# Altium project PCB_Project.PrjPcb
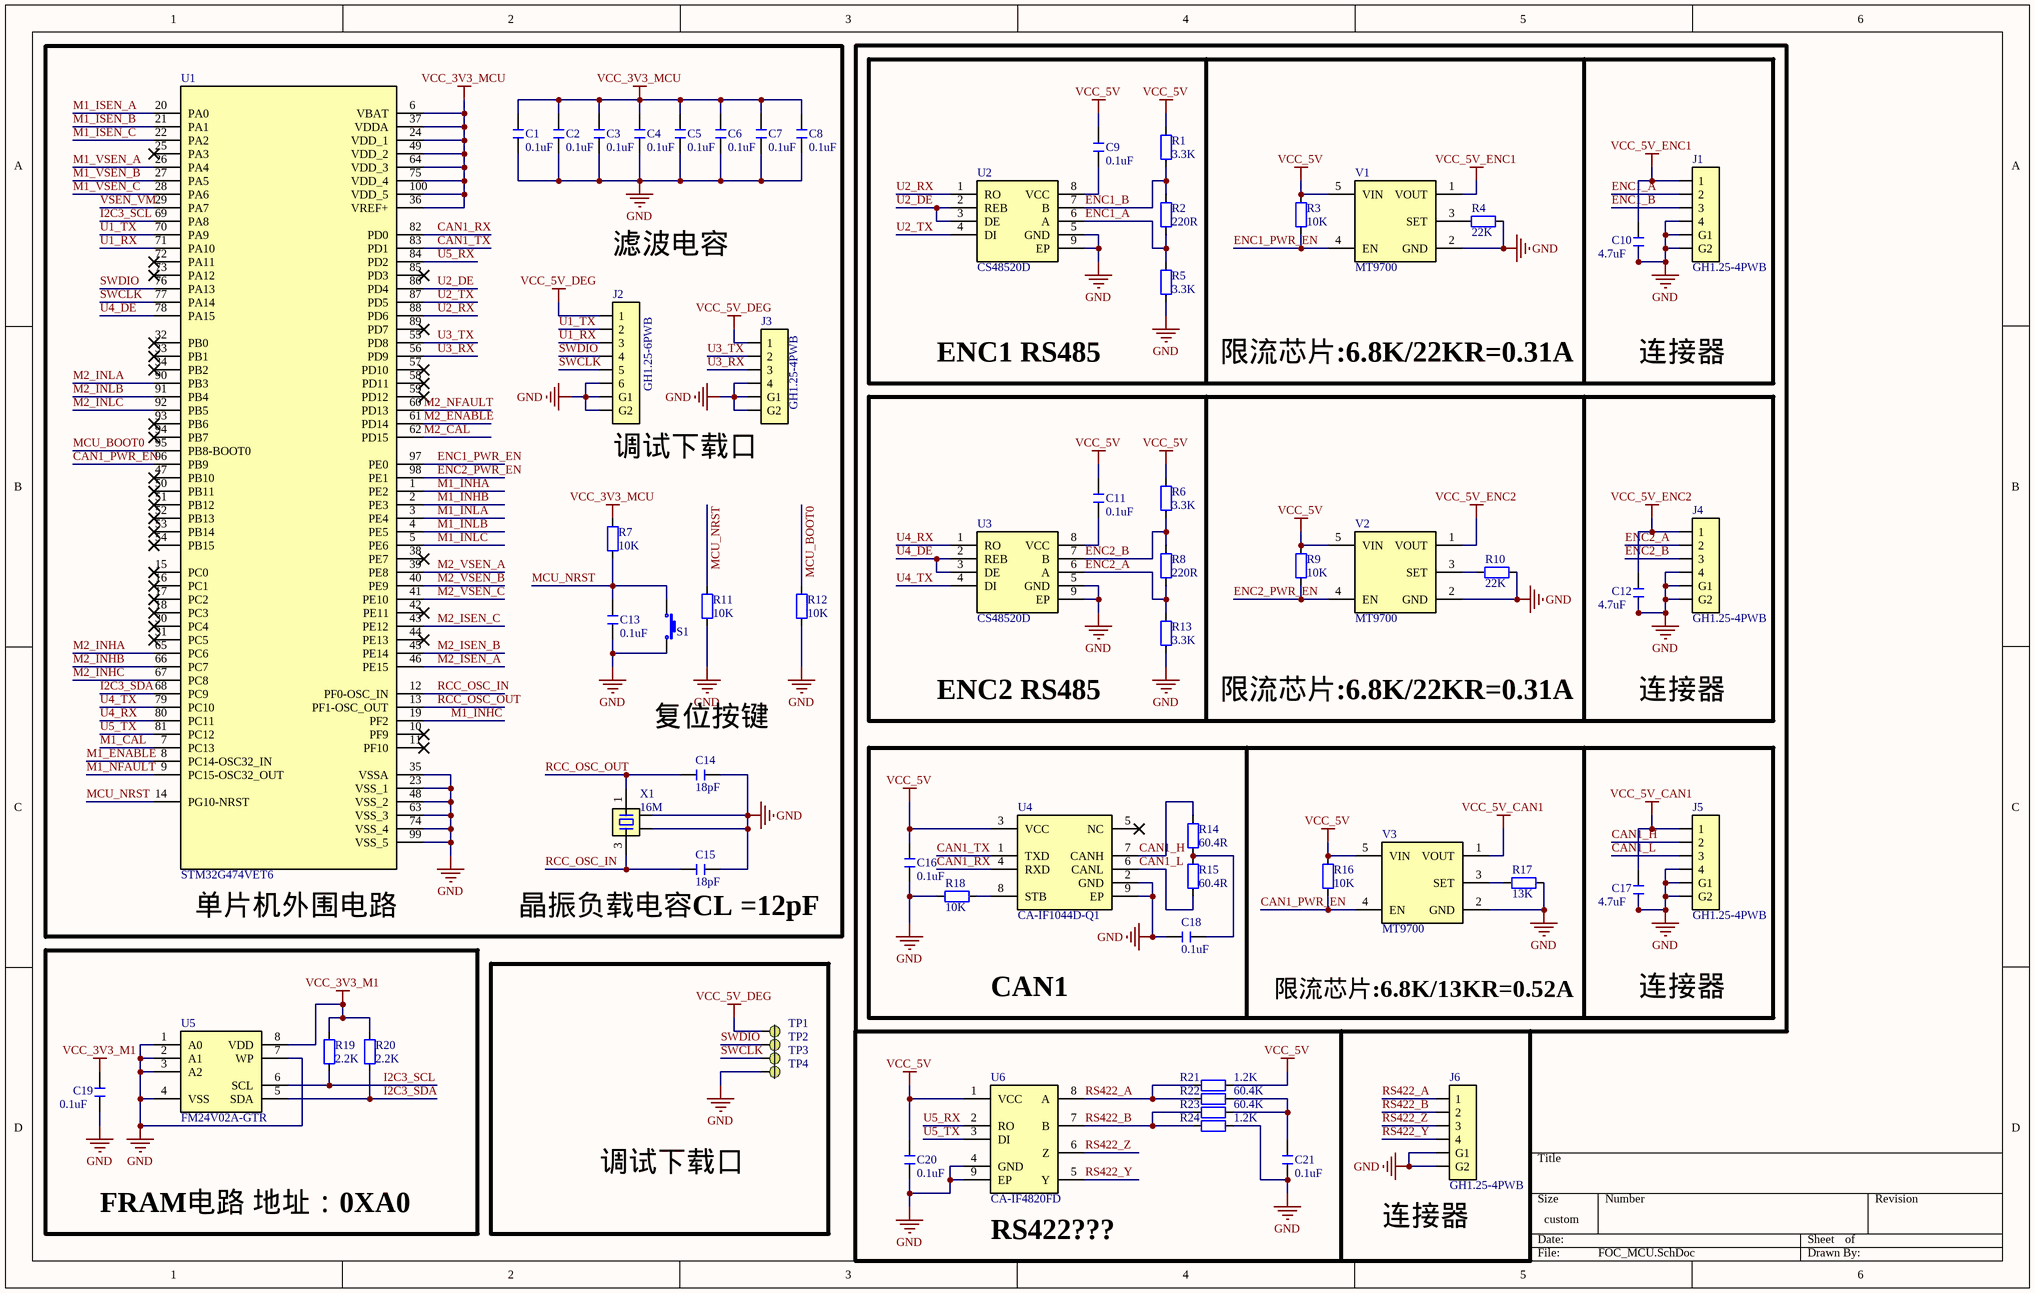
[diagram p0: FOC_MCU.SchDoc]
3 sheets, 186 parts. Net scope: global (net labels, ports and power ports of the same name join across sheets).
Board file: Tow_FOC.PcbDoc
Sheets:
  FOC_MCU.SchDoc
  FOC_Power.SchDoc
  FOC_Drive.SchDoc

## Sheet FOC_MCU.SchDoc
size 381 x 241 mm; SheetNumber: 1; SheetTotal: 3

### Parts
C1  0.1uF  [C 0603_L]
C2  0.1uF  [C 0603_L]
C3  0.1uF  [C 0603_L]
C4  0.1uF  [C 0603_L]
C5  0.1uF  [C 0603_L]
C6  0.1uF  [C 0603_L]
C7  0.1uF  [C 0603_L]
C8  0.1uF  [C 0603_L]
C9  0.1uF  [C 0603_L]
C10  4.7uF  [C 0603_L]
C11  0.1uF  [C 0603_L]
C12  4.7uF  [C 0603_L]
C13  0.1uF  [C 0603_L]
C14  18pF  [C 0603_L]
C15  18pF  [C 0603_L]
C16  0.1uF  [C 0603_L]
C17  4.7uF  [C 0603_L]
C18  0.1uF  [C 0603_L]
C19  0.1uF  [C 0603_L]
C20  0.1uF  [C 0603_L]
C21  0.1uF  [C 0603_L]
J1  GH1.25-4PWB  [GH1.25-4PWB]
J2  GH1.25-6PWB  [GH1.25-6PWB]
J3  GH1.25-4PWB  [GH1.25-4PWB]
J4  GH1.25-4PWB  [GH1.25-4PWB]
J5  GH1.25-4PWB  [GH1.25-4PWB]
J6  GH1.25-4PWB  [GH1.25-4PWB]
R1  3.3K  [R 0603_L]
R2  220R  [R 0603_L]
R3  10K  [R 0603_L]
R4  22K  [R 0603_L]
R5  3.3K  [R 0603_L]
R6  3.3K  [R 0603_L]
R7  10K  [R 0603_L]
R8  220R  [R 0603_L]
R9  10K  [R 0603_L]
R10  22K  [R 0603_L]
R11  10K  [R 0603_L]
R12  10K  [R 0603_L]
R13  3.3K  [R 0603_L]
R14  60.4R  [R 0603_L]
R15  60.4R  [R 0603_L]
R16  10K  [R 0603_L]
R17  13K  [R 0603_L]
R18  10K  [R 0603_L]
R19  2.2K  [R 0603_L]
R20  2.2K  [R 0603_L]
R21  1.2K  [R 0603_L]
R22  60.4K  [R 0603_L]
R23  60.4K  [R 0603_L]
R24  1.2K  [R 0603_L]
S1  TS-1089S-02526  [SMD_TS-1089S]  (value not drawn)
TP1  (no value)  [TP_RECT_2x2]
TP2  (no value)  [TP_RECT_2x2]
TP3  (no value)  [TP_RECT_2x2]
TP4  (no value)  [TP_RECT_2x2]
U1  STM32G474VET6  [LQFP100_L]
U2  CS48520D  [DFN65P300X75-9N]
U3  CS48520D  [DFN65P300X75-9N]
U4  CA-IF1044D-Q1  [DFN65P300X75-9N]
U5  FM24V02A-GTR  [SOIC-8N]
U6  CA-IF4820FD  [DFN65P300X75-9N]
V1  MT9700  [SOT-23-5]
V2  MT9700  [SOT-23-5]
V3  MT9700  [SOT-23-5]
X1  16M  [OSC 2016-4P]

### Blocks framed on the sheet
FRAM电路 地址：0XA0: C19 R19 R20 U5
调试下载口: TP1-TP4

### Nets
GND: C1.2 C2.2 C3.2 C4.2 C5.2 C6.2 C7.2 C8.2 C10.1 C12.1 C13.2 C14.1 C15.1 C16.1 C17.1 C18.1 C19.1 C20.1 C21.1 J1.4 J1.G1 J1.G2 J2.6 J2.G1 J2.G2 J3.4 J3.G1 J3.G2 J4.4 J4.G1 J4.G2 J5.4 J5.G1 J5.G2 J6.G1 J6.G2 R4.1 R5.1 R10.1 R11.2 R12.2 R13.1 R17.1 R18.2 R24.1 S1.1 TP4.1 U1.23(VSS_1) U1.35(VSSA) U1.48(VSS_2) U1.63(VSS_3) U1.74(VSS_4) U1.99(VSS_5) U2.5(GND) U2.9(EP) U3.5(GND) U3.9(EP) U4.2(GND) U4.9(EP) U5.1(A0) U5.2(A1) U5.3(A2) U5.4(VSS) U5.7(WP) U6.4(GND) U6.9(EP) V1.2(GND) V2.2(GND) V3.2(GND) X1.2 X1.4
VCC_3V3_M1: C19.2 R19.2 R20.2 U5.8(VDD)
VCC_3V3_MCU: C1.1 C2.1 C3.1 C4.1 C5.1 C6.1 C7.1 C8.1 R7.1 U1.6(VBAT) U1.24(VDD_1) U1.36(VREF+) U1.37(VDDA) U1.49(VDD_2) U1.64(VDD_3) U1.75(VDD_4) U1.100(VDD_5)
VCC_5V: C9.2 C11.2 C16.2 C20.2 R1.2 R3.2 R6.2 R9.2 R16.2 R21.1 U4.3(VCC) U6.1(VCC) V1.5(VIN) V2.5(VIN) V3.5(VIN)
VCC_5V_CAN1: C17.2 J5.1 V3.1(VOUT)
VCC_5V_DEG: J2.1 J3.1 TP1.1
VCC_5V_ENC1: C10.2 J1.1 V1.1(VOUT)
VCC_5V_ENC2: C12.2 J4.1 V2.1(VOUT)
CAN1_H: J5.2 R14.1 U4.7(CANH)
CAN1_L: J5.3 R15.2 U4.6(CANL)
CAN1_PWR_EN: R16.1 U1.96(PB9) V3.4(EN)
CAN1_RX: U1.82(PD0) U4.4(RXD)
CAN1_TX: U1.83(PD1) U4.1(TXD)
ENC1_A: J1.2 R2.1 R5.2 U2.6(A)
ENC1_B: J1.3 R1.1 R2.2 U2.7(B)
ENC1_PWR_EN: R3.1 U1.97(PE0) V1.4(EN)
ENC2_A: J4.2 R8.1 R13.2 U3.6(A)
ENC2_B: J4.3 R6.1 R8.2 U3.7(B)
ENC2_PWR_EN: R9.1 U1.98(PE1) V2.4(EN)
I2C3_SCL: R19.1 U1.69(PA8) U5.6(SCL)
I2C3_SDA: R20.1 U1.68(PC9) U5.5(SDA)
M1_CAL: U1.7(PC13)
M1_ENABLE: U1.8(PC14-OSC32_IN)
M1_INHA: U1.1(PE2)
M1_INHB: U1.2(PE3)
M1_INHC: U1.19(PF2)
M1_INLA: U1.3(PE4)
M1_INLB: U1.4(PE5)
M1_INLC: U1.5(PE6)
M1_ISEN_A: U1.20(PA0)
M1_ISEN_B: U1.21(PA1)
M1_ISEN_C: U1.22(PA2)
M1_NFAULT: U1.9(PC15-OSC32_OUT)
M1_VSEN_A: U1.26(PA4)
M1_VSEN_B: U1.27(PA5)
M1_VSEN_C: U1.28(PA6)
M2_CAL: U1.62(PD15)
M2_ENABLE: U1.61(PD14)
M2_INHA: U1.65(PC6)
M2_INHB: U1.66(PC7)
M2_INHC: U1.67(PC8)
M2_INLA: U1.90(PB3)
M2_INLB: U1.91(PB4)
M2_INLC: U1.92(PB5)
M2_ISEN_A: U1.46(PE15)
M2_ISEN_B: U1.45(PE14)
M2_ISEN_C: U1.43(PE12)
M2_NFAULT: U1.60(PD13)
M2_VSEN_A: U1.39(PE8)
M2_VSEN_B: U1.40(PE9)
M2_VSEN_C: U1.41(PE10)
MCU_BOOT0: R12.1 U1.95(PB8-BOOT0)
MCU_NRST: C13.1 R7.2 R11.1 S1.2 U1.14(PG10-NRST)
RCC_OSC_IN: C15.2 U1.12(PF0-OSC_IN) X1.3
RCC_OSC_OUT: C14.2 U1.13(PF1-OSC_OUT) X1.1
RS422_A: J6.1 R21.2 R22.2 U6.8(A)
RS422_B: J6.2 R23.2 R24.2 U6.7(B)
RS422_Y: J6.4 U6.5(Y)
RS422_Z: J6.3 U6.6(Z)
SWCLK: J2.5 TP3.1 U1.77(PA14)
SWDIO: J2.4 TP2.1 U1.76(PA13)
U1_RX: J2.3 U1.71(PA10)
U1_TX: J2.2 U1.70(PA9)
U2_DE: U1.86(PD4) U2.2(REB) U2.3(DE)
U2_RX: U1.88(PD6) U2.1(RO)
U2_TX: U1.87(PD5) U2.4(DI)
U3_RX: J3.3 U1.56(PD9)
U3_TX: J3.2 U1.55(PD8)
U4_DE: U1.78(PA15) U3.2(REB) U3.3(DE)
U4_RX: U1.80(PC11) U3.1(RO)
U4_TX: U1.79(PC10) U3.4(DI)
U5_RX: U1.84(PD2) U6.2(RO)
U5_TX: U1.81(PC12) U6.3(DI)
VSEN_VM: U1.29(PA7)
NetC9_1: C9.1 U2.8(VCC)
NetC11_1: C11.1 U3.8(VCC)
NetC18_2: C18.2 R14.2 R15.1
NetC21_2: C21.2 R22.1 R23.1
NetR4_2: R4.2 V1.3(SET)
NetR10_2: R10.2 V2.3(SET)
NetR17_2: R17.2 V3.3(SET)
NetR18_1: R18.1 U4.8(STB)

Not connected (* = marked no-connect by the designer): U1 10(PF9)* 11(PF10)* 15(PC0)* 16(PC1)* 17(PC2)* 18(PC3)* 25(PA3)* 30(PC4)* 31(PC5)* 32(PB0)* 33(PB1)* 34(PB2)* 38(PE7)* 42(PE11)* 44(PE13)* 47(PB10)* 50(PB11)* 51(PB12)* 52(PB13)* 53(PB14)* 54(PB15)* 57(PD10)* 58(PD11)* 59(PD12)* 72(PA11)* 73(PA12)* 85(PD3)* 89(PD7)* 93(PB6)* 94(PB7)*; U4 5(NC)*

### Notes on the sheet
- 滤波电容
- ENC1 RS485
- 限流芯片:6.8K/22KR=0.31A
- 连接器
- (near J2) 调试下载口
- ENC2 RS485
- 复位按键
- (near U1) 单片机外围电路
- (near C15) 晶振负载电容CL =12pF
- CAN1
- 限流芯片:6.8K/13KR=0.52A
- (near U6) RS422???
- (near J6) 连接器

### Library data of the parts
C1-C21 = C: 贴片电容; BOM名称: 无极性贴片电容
J1 J3-J6 = GH1.25-4PWB: GH1.25-4P 卧贴
J2 = GH1.25-6PWB: GH1.25-6P 卧贴
R1-R24 = R: 贴片电阻; BOM名称: 贴片电阻
TP1-TP4 = TP
U1 = STM32G474VET6: STM32G4系列微处理器
U2 U3 = CS48520D: RS485
U4 = CA-IF1044D-Q1: CAN收发器，5Mbps
U6 = CA-IF4820FD: RS422，3.3V/5V，20Mbps
V1-V3 = MT9700: 功率电子开关
X1 = X201616MOB4SI: 4脚无源晶振，负载电容12pF; BOM名称: 4脚无源晶振

## Sheet FOC_Power.SchDoc
size A4; SheetNumber: 2; SheetTotal: 3
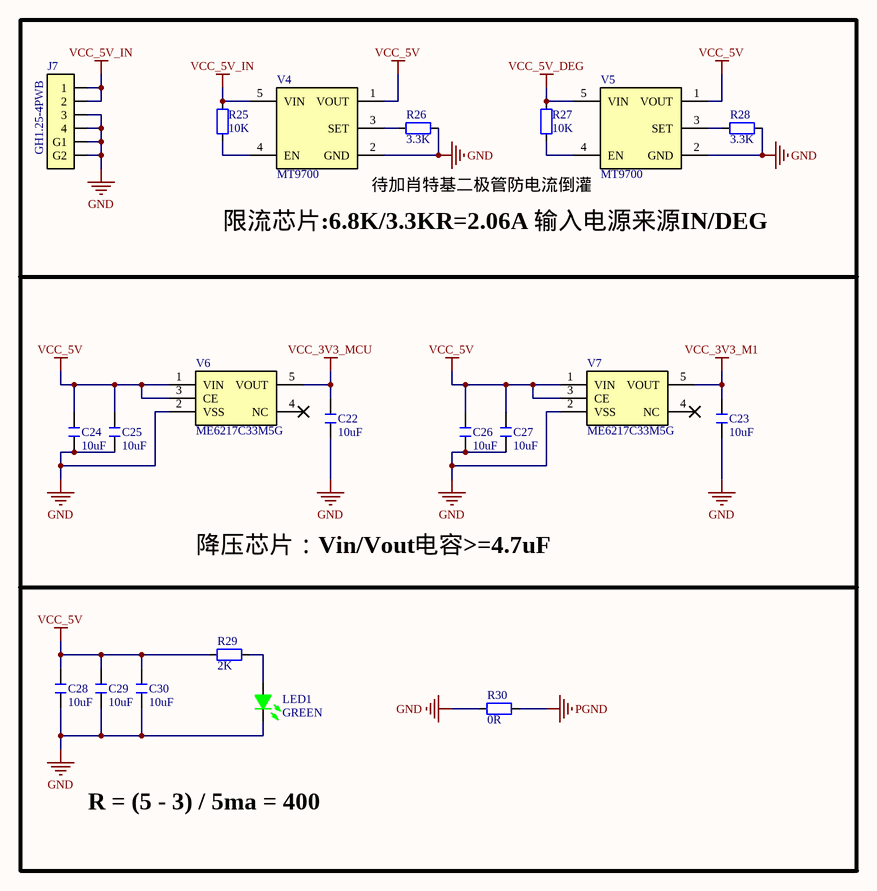
[diagram p1: FOC_Power.SchDoc]

### Parts
C22  10uF  [C 0603_L]
C23  10uF  [C 0603_L]
C24  10uF  [C 0603_L]
C25  10uF  [C 0603_L]
C26  10uF  [C 0603_L]
C27  10uF  [C 0603_L]
C28  10uF  [C 0603_L]
C29  10uF  [C 0603_L]
C30  10uF  [C 0603_L]
J7  GH1.25-4PWB  [GH1.25-4PWB]
LED1  GREEN  [LED_0603G]
R25  10K  [R 0603_L]
R26  3.3K  [R 0603_L]
R27  10K  [R 0603_L]
R28  3.3K  [R 0603_L]
R29  2K  [R 0603_L]
R30  0R  [R 0603_L]
V4  MT9700  [SOT-23-5]
V5  MT9700  [SOT-23-5]
V6  ME6217C33M5G  [SOT-23-5L]
V7  ME6217C33M5G  [SOT-23-5L]

### Nets
GND: C22.2 C23.2 C24.2 C25.2 C26.2 C27.2 C28.1 C29.2 C30.2 J7.3 J7.4 J7.G1 J7.G2 LED1.2(-) R26.1 R28.1 R30.1 V4.2(GND) V5.2(GND) V6.2(VSS) V7.2(VSS)
PGND: R30.2
VCC_3V3_M1: C23.1 V7.5(VOUT)
VCC_3V3_MCU: C22.1 V6.5(VOUT)
VCC_5V: C24.1 C25.1 C26.1 C27.1 C28.2 C29.1 C30.1 R29.1 V4.1(VOUT) V5.1(VOUT) V6.1(VIN) V6.3(CE) V7.1(VIN) V7.3(CE)
VCC_5V_DEG: R27.2 V5.5(VIN)
VCC_5V_IN: J7.1 J7.2 R25.2 V4.5(VIN)
NetLED1_1: LED1.1(+) R29.2
NetR25_1: R25.1 V4.4(EN)
NetR26_2: R26.2 V4.3(SET)
NetR27_1: R27.1 V5.4(EN)
NetR28_2: R28.2 V5.3(SET)

Not connected (* = marked no-connect by the designer): V6 4(NC)*; V7 4(NC)*

### Notes on the sheet
- (near V4) 待加肖特基二极管防电流倒灌
- 限流芯片:6.8K/3.3KR=2.06A 输入电源来源IN/DEG
- 降压芯片：Vin/Vout电容>=4.7uF
- R = (5 - 3) / 5ma = 400

### Library data of the parts
C22-C30 = C: 贴片电容; BOM名称: 无极性贴片电容
J7 = GH1.25-4PWB: GH1.25-4P 卧贴
LED1 = LED_G: 贴片LED 0603 绿色
R25-R30 = R: 贴片电阻; BOM名称: 贴片电阻
V4 V5 = MT9700: 功率电子开关

## Sheet FOC_Drive.SchDoc
size A3; SheetNumber: 3; SheetTotal: 3
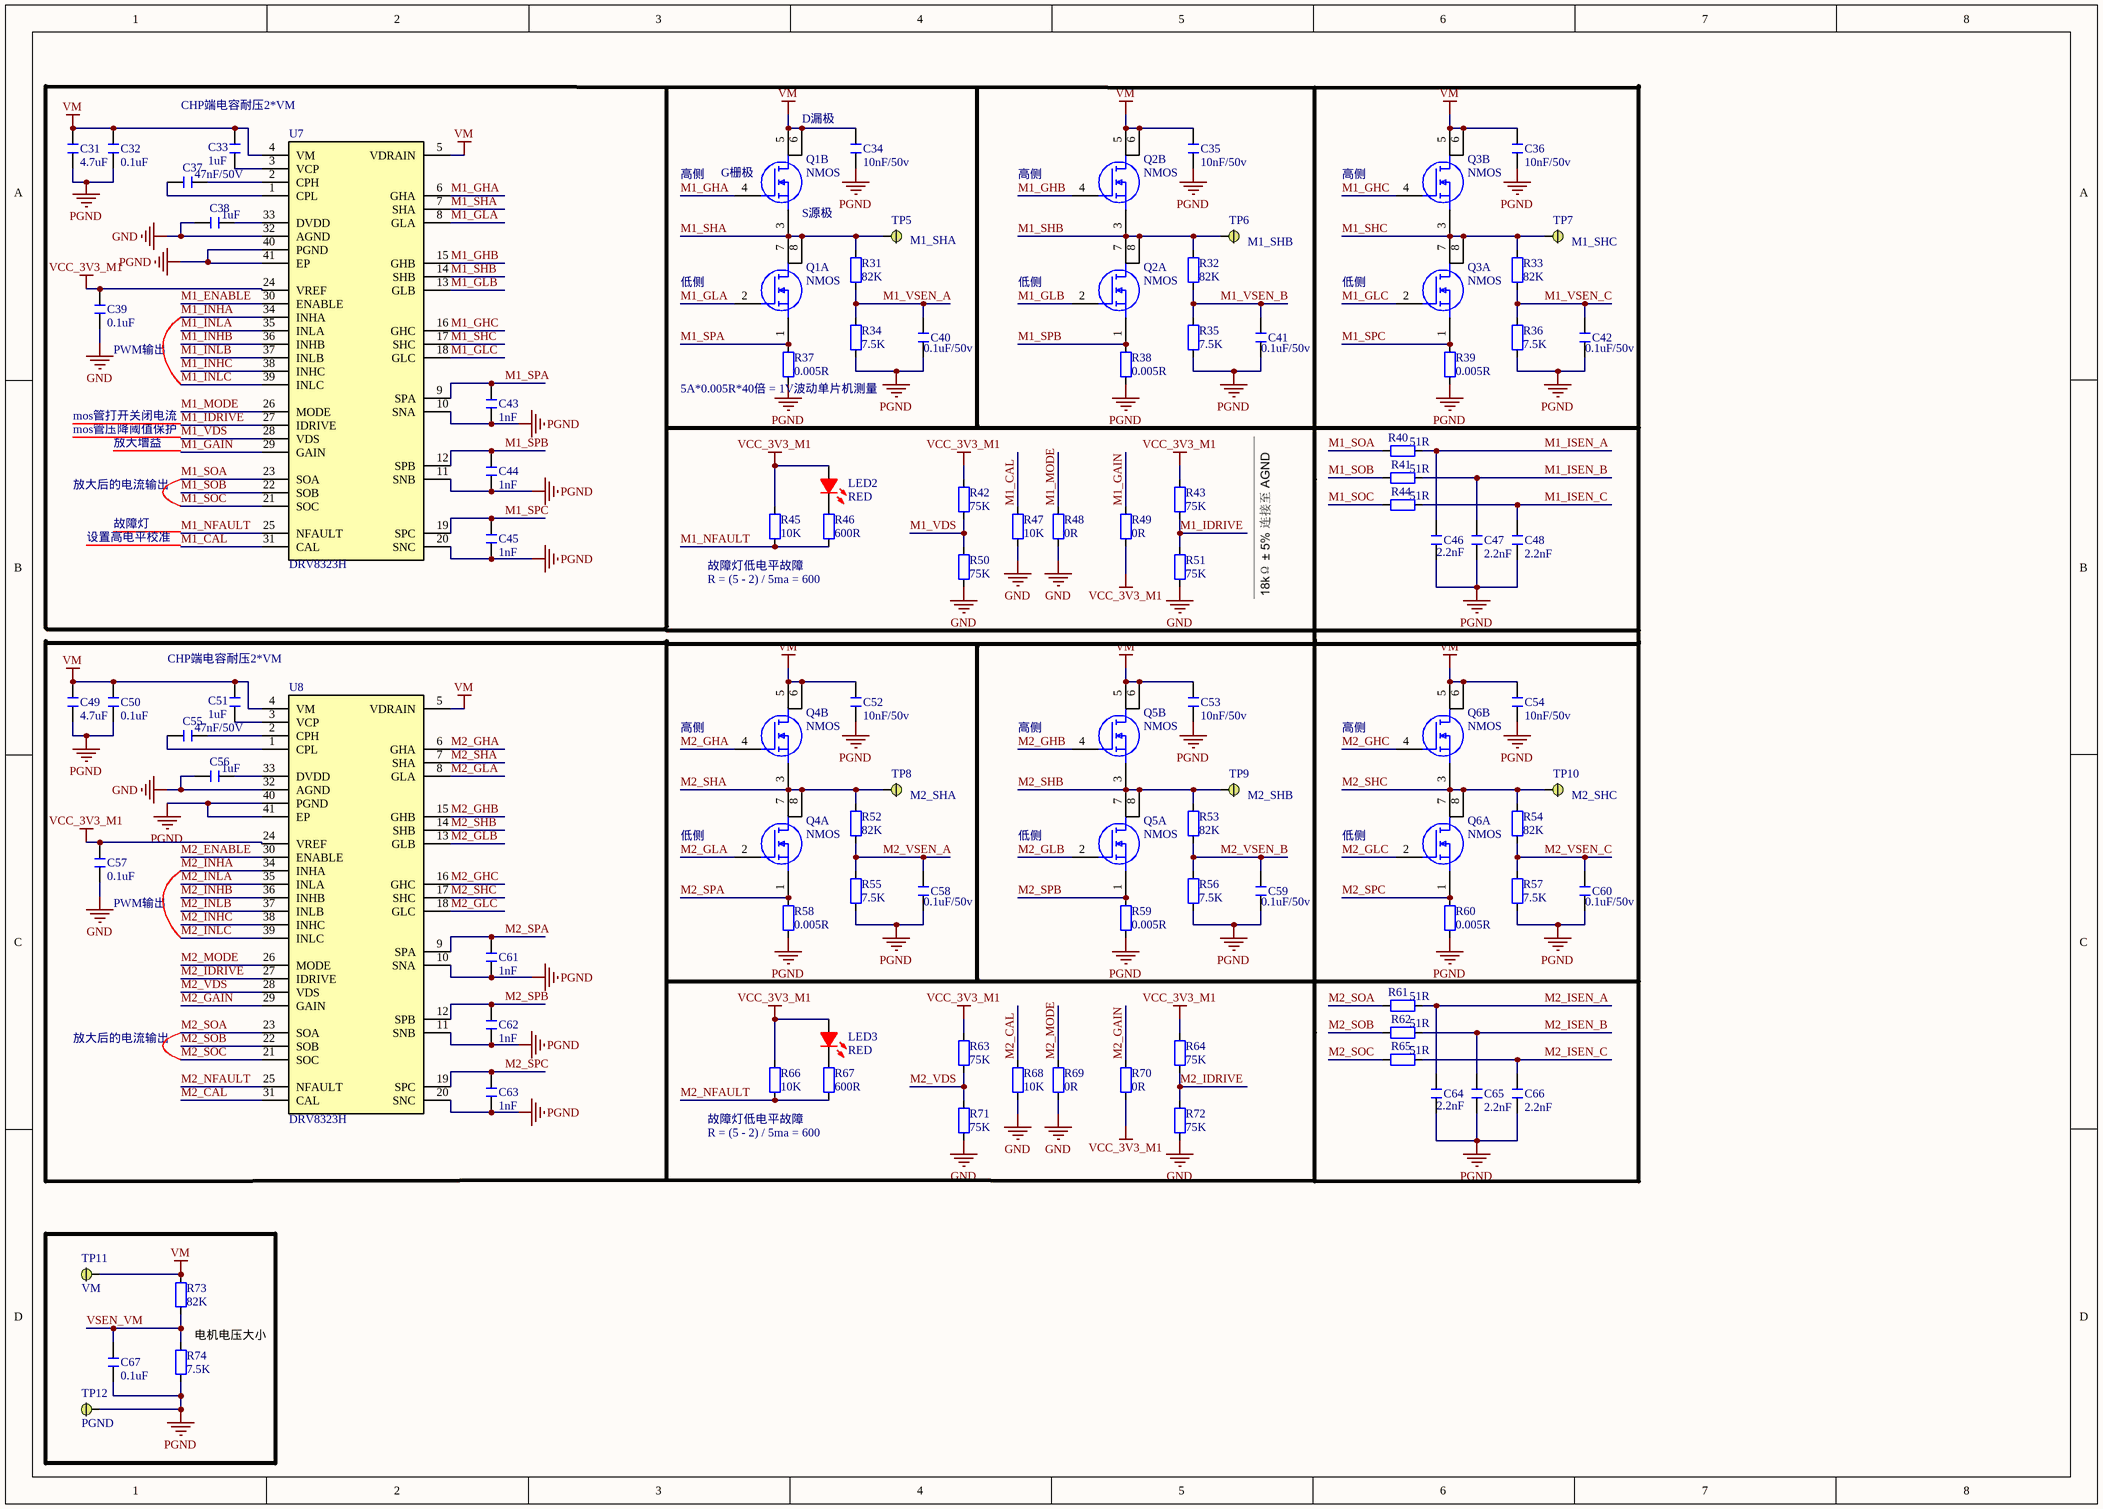
[diagram p2: FOC_Drive.SchDoc]

### Parts
C31  4.7uF  [C 0603_L]
C32  0.1uF  [C 0603_L]
C33  1uF  [C 0603_L]
C34  10nF/50v  [C 0603_L]
C35  10nF/50v  [C 0603_L]
C36  10nF/50v  [C 0603_L]
C37  47nF/50V  [C 0603_L]
C38  1uF  [C 0603_L]
C39  0.1uF  [C 0603_L]
C40  0.1uF/50v  [C 0603_L]
C41  0.1uF/50v  [C 0603_L]
C42  0.1uF/50v  [C 0603_L]
C43  1nF  [C 0603_L]
C44  1nF  [C 0603_L]
C45  1nF  [C 0603_L]
C46  2.2nF  [C 0603_L]
C47  2.2nF  [C 0603_L]
C48  2.2nF  [C 0603_L]
C49  4.7uF  [C 0603_L]
C50  0.1uF  [C 0603_L]
C51  1uF  [C 0603_L]
C52  10nF/50v  [C 0603_L]
C53  10nF/50v  [C 0603_L]
C54  10nF/50v  [C 0603_L]
C55  47nF/50V  [C 0603_L]
C56  1uF  [C 0603_L]
C57  0.1uF  [C 0603_L]
C58  0.1uF/50v  [C 0603_L]
C59  0.1uF/50v  [C 0603_L]
C60  0.1uF/50v  [C 0603_L]
C61  1nF  [C 0603_L]
C62  1nF  [C 0603_L]
C63  1nF  [C 0603_L]
C64  2.2nF  [C 0603_L]
C65  2.2nF  [C 0603_L]
C66  2.2nF  [C 0603_L]
C67  0.1uF  [C 0603_L]
LED2  RED  [LED_0603R]
LED3  RED  [LED_0603R]
Q1  NMOS  [DFN-8_L5.8-W4.9-P1.27-LS6.0-BL]  (parts A,B of 2)
Q2  NMOS  [DFN-8_L5.8-W4.9-P1.27-LS6.0-BL]  (parts A,B of 2)
Q3  NMOS  [DFN-8_L5.8-W4.9-P1.27-LS6.0-BL]  (parts A,B of 2)
Q4  NMOS  [DFN-8_L5.8-W4.9-P1.27-LS6.0-BL]  (parts A,B of 2)
Q5  NMOS  [DFN-8_L5.8-W4.9-P1.27-LS6.0-BL]  (parts A,B of 2)
Q6  NMOS  [DFN-8_L5.8-W4.9-P1.27-LS6.0-BL]  (parts A,B of 2)
R31  82K  [R 0603_L]
R32  82K  [R 0603_L]
R33  82K  [R 0603_L]
R34  7.5K  [R 0603_L]
R35  7.5K  [R 0603_L]
R36  7.5K  [R 0603_L]
R37  0.005R  [R 2512_L]
R38  0.005R  [R 2512_L]
R39  0.005R  [R 2512_L]
R40  51R  [R 0603_L]
R41  51R  [R 0603_L]
R42  75K  [R 0603_L]
R43  75K  [R 0603_L]
R44  51R  [R 0603_L]
R45  10K  [R 0603_L]
R46  600R  [R 0603_L]
R47  10K  [R 0603_L]
R48  0R  [R 0603_L]
R49  0R  [R 0603_L]
R50  75K  [R 0603_L]
R51  75K  [R 0603_L]
R52  82K  [R 0603_L]
R53  82K  [R 0603_L]
R54  82K  [R 0603_L]
R55  7.5K  [R 0603_L]
R56  7.5K  [R 0603_L]
R57  7.5K  [R 0603_L]
R58  0.005R  [R 2512_L]
R59  0.005R  [R 2512_L]
R60  0.005R  [R 2512_L]
R61  51R  [R 0603_L]
R62  51R  [R 0603_L]
R63  75K  [R 0603_L]
R64  75K  [R 0603_L]
R65  51R  [R 0603_L]
R66  10K  [R 0603_L]
R67  600R  [R 0603_L]
R68  10K  [R 0603_L]
R69  0R  [R 0603_L]
R70  0R  [R 0603_L]
R71  75K  [R 0603_L]
R72  75K  [R 0603_L]
R73  82K  [R 0603_L]
R74  7.5K  [R 0603_L]
TP5  M1_SHA  [TP_RECT_2x2]
TP6  M1_SHB  [TP_RECT_2x2]
TP7  M1_SHC  [TP_RECT_2x2]
TP8  M2_SHA  [TP_RECT_2x2]
TP9  M2_SHB  [TP_RECT_2x2]
TP10  M2_SHC  [TP_RECT_2x2]
TP11  VM  [TP_RECT_2x2]
TP12  PGND  [TP_RECT_2x2]
U7  DRV8323H  [QFN50P600X600X80-41N-D]
U8  DRV8323H  [QFN50P600X600X80-41N-D]

### Blocks framed on the sheet
电机电压大小: C67 R73 R74 TP11 TP12

### Nets
GND: C38.1 C39.1 C56.1 C57.1 R47.2 R48.1 R50.2 R51.2 R68.2 R69.1 R71.2 R72.2 U7.32(AGND) U8.32(AGND)
PGND: C31.1 C32.1 C34.1 C35.1 C36.1 C40.1 C41.1 C42.1 C43.2 C44.2 C45.2 C46.1 C47.1 C48.1 C49.1 C50.1 C52.1 C53.1 C54.1 C58.1 C59.1 C60.1 C61.2 C62.2 C63.2 C64.1 C65.1 C66.1 C67.1 R34.1 R35.1 R36.1 R37.1 R38.1 R39.1 R55.1 R56.1 R57.1 R58.1 R59.1 R60.1 R74.2 TP12.1 U7.10(SNA) U7.11(SNB) U7.20(SNC) U7.40(PGND) U7.41(EP) U8.10(SNA) U8.11(SNB) U8.20(SNC) U8.40(PGND) U8.41(EP)
VCC_3V3_M1: C39.2 C57.2 LED2.1(+) LED3.1(+) R42.1 R43.1 R45.1 R49.1 R63.1 R64.1 R66.1 R70.1 U7.24(VREF) U8.24(VREF)
VM: C31.2 C32.2 C33.2 C34.2 C35.2 C36.2 C49.2 C50.2 C51.2 C52.2 C53.2 C54.2 Q1.5(D2) Q1.6(D2) Q2.5(D2) Q2.6(D2) Q3.5(D2) Q3.6(D2) Q4.5(D2) Q4.6(D2) Q5.5(D2) Q5.6(D2) Q6.5(D2) Q6.6(D2) R73.1 TP11.1 U7.4(VM) U7.5(VDRAIN) U8.4(VM) U8.5(VDRAIN)
M1_CAL: R47.1 U7.31(CAL)
M1_ENABLE: U7.30(ENABLE)
M1_GAIN: R49.2 U7.29(GAIN)
M1_GHA: Q1.4(G2) U7.6(GHA)
M1_GHB: Q2.4(G2) U7.15(GHB)
M1_GHC: Q3.4(G2) U7.16(GHC)
M1_GLA: Q1.2(G1) U7.8(GLA)
M1_GLB: Q2.2(G1) U7.13(GLB)
M1_GLC: Q3.2(G1) U7.18(GLC)
M1_IDRIVE: R43.2 R51.1 U7.27(IDRIVE)
M1_INHA: U7.34(INHA)
M1_INHB: U7.36(INHB)
M1_INHC: U7.38(INHC)
M1_INLA: U7.35(INLA)
M1_INLB: U7.37(INLB)
M1_INLC: U7.39(INLC)
M1_ISEN_A: C46.2 R40.1
M1_ISEN_B: C47.2 R41.1
M1_ISEN_C: C48.2 R44.1
M1_MODE: R48.2 U7.26(MODE)
M1_NFAULT: R45.2 R46.2 U7.25(NFAULT)
M1_SHA: Q1.3(S2) Q1.7(D1) Q1.8(D1) R31.2 TP5.1 U7.7(SHA)
M1_SHB: Q2.3(S2) Q2.7(D1) Q2.8(D1) R32.2 TP6.1 U7.14(SHB)
M1_SHC: Q3.3(S2) Q3.7(D1) Q3.8(D1) R33.2 TP7.1 U7.17(SHC)
M1_SOA: R40.2 U7.23(SOA)
M1_SOB: R41.2 U7.22(SOB)
M1_SOC: R44.2 U7.21(SOC)
M1_SPA: C43.1 Q1.1(S1) R37.2 U7.9(SPA)
M1_SPB: C44.1 Q2.1(S1) R38.2 U7.12(SPB)
M1_SPC: C45.1 Q3.1(S1) R39.2 U7.19(SPC)
M1_VDS: R42.2 R50.1 U7.28(VDS)
M1_VSEN_A: C40.2 R31.1 R34.2
M1_VSEN_B: C41.2 R32.1 R35.2
M1_VSEN_C: C42.2 R33.1 R36.2
M2_CAL: R68.1 U8.31(CAL)
M2_ENABLE: U8.30(ENABLE)
M2_GAIN: R70.2 U8.29(GAIN)
M2_GHA: Q4.4(G2) U8.6(GHA)
M2_GHB: Q5.4(G2) U8.15(GHB)
M2_GHC: Q6.4(G2) U8.16(GHC)
M2_GLA: Q4.2(G1) U8.8(GLA)
M2_GLB: Q5.2(G1) U8.13(GLB)
M2_GLC: Q6.2(G1) U8.18(GLC)
M2_IDRIVE: R64.2 R72.1 U8.27(IDRIVE)
M2_INHA: U8.34(INHA)
M2_INHB: U8.36(INHB)
M2_INHC: U8.38(INHC)
M2_INLA: U8.35(INLA)
M2_INLB: U8.37(INLB)
M2_INLC: U8.39(INLC)
M2_ISEN_A: C64.2 R61.1
M2_ISEN_B: C65.2 R62.1
M2_ISEN_C: C66.2 R65.1
M2_MODE: R69.2 U8.26(MODE)
M2_NFAULT: R66.2 R67.2 U8.25(NFAULT)
M2_SHA: Q4.3(S2) Q4.7(D1) Q4.8(D1) R52.2 TP8.1 U8.7(SHA)
M2_SHB: Q5.3(S2) Q5.7(D1) Q5.8(D1) R53.2 TP9.1 U8.14(SHB)
M2_SHC: Q6.3(S2) Q6.7(D1) Q6.8(D1) R54.2 TP10.1 U8.17(SHC)
M2_SOA: R61.2 U8.23(SOA)
M2_SOB: R62.2 U8.22(SOB)
M2_SOC: R65.2 U8.21(SOC)
M2_SPA: C61.1 Q4.1(S1) R58.2 U8.9(SPA)
M2_SPB: C62.1 Q5.1(S1) R59.2 U8.12(SPB)
M2_SPC: C63.1 Q6.1(S1) R60.2 U8.19(SPC)
M2_VDS: R63.2 R71.1 U8.28(VDS)
M2_VSEN_A: C58.2 R52.1 R55.2
M2_VSEN_B: C59.2 R53.1 R56.2
M2_VSEN_C: C60.2 R54.1 R57.2
VSEN_VM: C67.2 R73.2 R74.1
NetC33_1: C33.1 U7.3(VCP)
NetC37_1: C37.1 U7.2(CPH)
NetC37_2: C37.2 U7.1(CPL)
NetC38_2: C38.2 U7.33(DVDD)
NetC51_1: C51.1 U8.3(VCP)
NetC55_1: C55.1 U8.2(CPH)
NetC55_2: C55.2 U8.1(CPL)
NetC56_2: C56.2 U8.33(DVDD)
NetLED2_2: LED2.2(-) R46.1
NetLED3_2: LED3.2(-) R67.1

### Notes on the sheet
- (near C33) CHP端电容耐压2*VM
- 高侧
- (near Q1) G栅极
- D漏极
- (near Q1) S源极
- 低侧
- (near C39) PWM输出
- mos管压降阈值保护
- mos管打开关闭电流
- 放大增益
- (near R37) 5A*0.005R*40倍 = 1V波动单片机测量
- 放大后的电流输出
- 设置高电平校准
- 故障灯
- (near R45) 故障灯低电平故障
- R = (5 - 2) / 5ma = 600
- (near C51) CHP端电容耐压2*VM
- (near C57) PWM输出
- (near R66) 故障灯低电平故障

### Library data of the parts
C31-C67 = C: 贴片电容; BOM名称: 无极性贴片电容
LED2 LED3 = LED_R: 贴片LED 0603 红色
Q1-Q6 = NCEP01ND35AG: NMOS，100V，35A，2 channel
R31-R74 = R: 贴片电阻; BOM名称: 贴片电阻
TP5-TP12 = TP
U7 U8 = DRV8323H: 三相智能栅极驱动器; Manufacturer_Name: Texas Instruments; Datasheet Link: https://www.ti.com/lit/ds/symlink/drv8323.pdf?ts=1615227518000&ref_url=https%253A%252F%252Fwww.google.com%252F; Height: 0.8mm; Manufacturer_Part_Number: DRV8323

## Nets that join several sheets
GND: FOC_MCU (71 pins), FOC_Power (21 pins), FOC_Drive (14 pins)
PGND: FOC_Power (R30.2), FOC_Drive (53 pins)
VCC_3V3_M1: FOC_MCU (C19.2 R19.2 R20.2 U5.8), FOC_Power (C23.1 V7.5), FOC_Drive (14 pins)
VCC_3V3_MCU: FOC_MCU (17 pins), FOC_Power (C22.1 V6.5)
VCC_5V: FOC_MCU (15 pins), FOC_Power (14 pins)
VCC_5V_DEG: FOC_MCU (J2.1 J3.1 TP1.1), FOC_Power (R27.2 V5.5)
M1_CAL: FOC_MCU (U1.7), FOC_Drive (R47.1 U7.31)
M1_ENABLE: FOC_MCU (U1.8), FOC_Drive (U7.30)
M1_INHA: FOC_MCU (U1.1), FOC_Drive (U7.34)
M1_INHB: FOC_MCU (U1.2), FOC_Drive (U7.36)
M1_INHC: FOC_MCU (U1.19), FOC_Drive (U7.38)
M1_INLA: FOC_MCU (U1.3), FOC_Drive (U7.35)
M1_INLB: FOC_MCU (U1.4), FOC_Drive (U7.37)
M1_INLC: FOC_MCU (U1.5), FOC_Drive (U7.39)
M1_ISEN_A: FOC_MCU (U1.20), FOC_Drive (C46.2 R40.1)
M1_ISEN_B: FOC_MCU (U1.21), FOC_Drive (C47.2 R41.1)
M1_ISEN_C: FOC_MCU (U1.22), FOC_Drive (C48.2 R44.1)
M1_NFAULT: FOC_MCU (U1.9), FOC_Drive (R45.2 R46.2 U7.25)
M1_VSEN_A: FOC_MCU (U1.26), FOC_Drive (C40.2 R31.1 R34.2)
M1_VSEN_B: FOC_MCU (U1.27), FOC_Drive (C41.2 R32.1 R35.2)
M1_VSEN_C: FOC_MCU (U1.28), FOC_Drive (C42.2 R33.1 R36.2)
M2_CAL: FOC_MCU (U1.62), FOC_Drive (R68.1 U8.31)
M2_ENABLE: FOC_MCU (U1.61), FOC_Drive (U8.30)
M2_INHA: FOC_MCU (U1.65), FOC_Drive (U8.34)
M2_INHB: FOC_MCU (U1.66), FOC_Drive (U8.36)
M2_INHC: FOC_MCU (U1.67), FOC_Drive (U8.38)
M2_INLA: FOC_MCU (U1.90), FOC_Drive (U8.35)
M2_INLB: FOC_MCU (U1.91), FOC_Drive (U8.37)
M2_INLC: FOC_MCU (U1.92), FOC_Drive (U8.39)
M2_ISEN_A: FOC_MCU (U1.46), FOC_Drive (C64.2 R61.1)
M2_ISEN_B: FOC_MCU (U1.45), FOC_Drive (C65.2 R62.1)
M2_ISEN_C: FOC_MCU (U1.43), FOC_Drive (C66.2 R65.1)
M2_NFAULT: FOC_MCU (U1.60), FOC_Drive (R66.2 R67.2 U8.25)
M2_VSEN_A: FOC_MCU (U1.39), FOC_Drive (C58.2 R52.1 R55.2)
M2_VSEN_B: FOC_MCU (U1.40), FOC_Drive (C59.2 R53.1 R56.2)
M2_VSEN_C: FOC_MCU (U1.41), FOC_Drive (C60.2 R54.1 R57.2)
VSEN_VM: FOC_MCU (U1.29), FOC_Drive (C67.2 R73.2 R74.1)